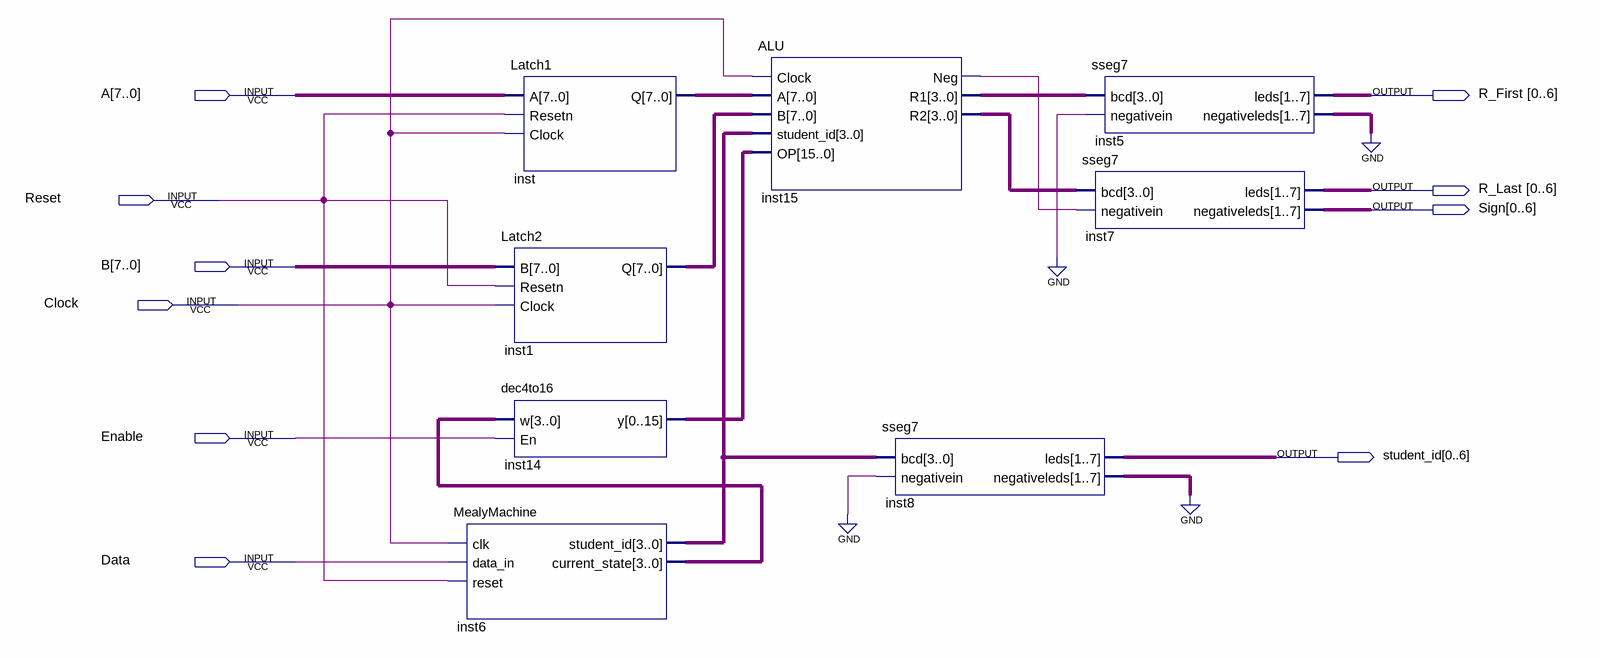
[diagram p0: schematic sheet]
// Quartus schematic Fig_6.bdf as structural Verilog: 8 symbols, 10 pins
module Fig_6 (
  input  [7:0] A,
  input  Reset,
  input  [7:0] B,
  input  Clock,
  input  Enable,
  input  Data,
  output [0:6] R_First,
  output [0:6] R_Last,
  output [0:6] Sign,
  output [0:6] student_id
);

  wire inst15_neg;
  wire [3:0] inst6_current_state, inst6_student_id, inst15_r1, inst15_r2;
  wire [6:0] inst5_negativeleds, inst8_negativeleds;
  wire [7:0] inst1_q, inst_q;
  wire [15:0] inst14_y;

  MealyMachine inst6 (
    .clk(Clock), .data_in(Data), .reset(Reset), .student_id(inst6_student_id),
    .current_state(inst6_current_state));
  Latch1 inst (.A(A), .Resetn(Reset), .Clock(Clock), .Q(inst_q));
  Latch2 inst1 (.B(B), .Resetn(Reset), .Clock(Clock), .Q(inst1_q));
  dec4to16 inst14 (.w(inst6_current_state), .En(Enable), .y(inst14_y));
  ALU inst15 (
    .Clock(Clock), .A(inst_q), .B(inst1_q), .student_id(inst6_student_id), .OP(inst14_y), .Neg(inst15_neg),
    .R1(inst15_r1), .R2(inst15_r2));
  sseg7 inst8 (.bcd(inst6_student_id), .negativein(1'b0), .leds(student_id), .negativeleds(inst8_negativeleds));
  sseg7 inst7 (.bcd(inst15_r2), .negativein(inst15_neg), .leds(R_Last), .negativeleds(Sign));
  sseg7 inst5 (.bcd(inst15_r1), .negativein(1'b0), .leds(R_First), .negativeleds(inst5_negativeleds));
  // also tied to GND on the sheet: {inst5_negativeleds[0], inst5_negativeleds[1], inst5_negativeleds[2], inst5_negativeleds[3], inst5_negativeleds[4], inst5_negativeleds[5], inst5_negativeleds[6], inst8_negativeleds[0], inst8_negativeleds[1], inst8_negativeleds[2], inst8_negativeleds[3], inst8_negativeleds[4], inst8_negativeleds[5], inst8_negativeleds[6]}
endmodule
